# Altium project Microcontroller_Board.PrjPcb
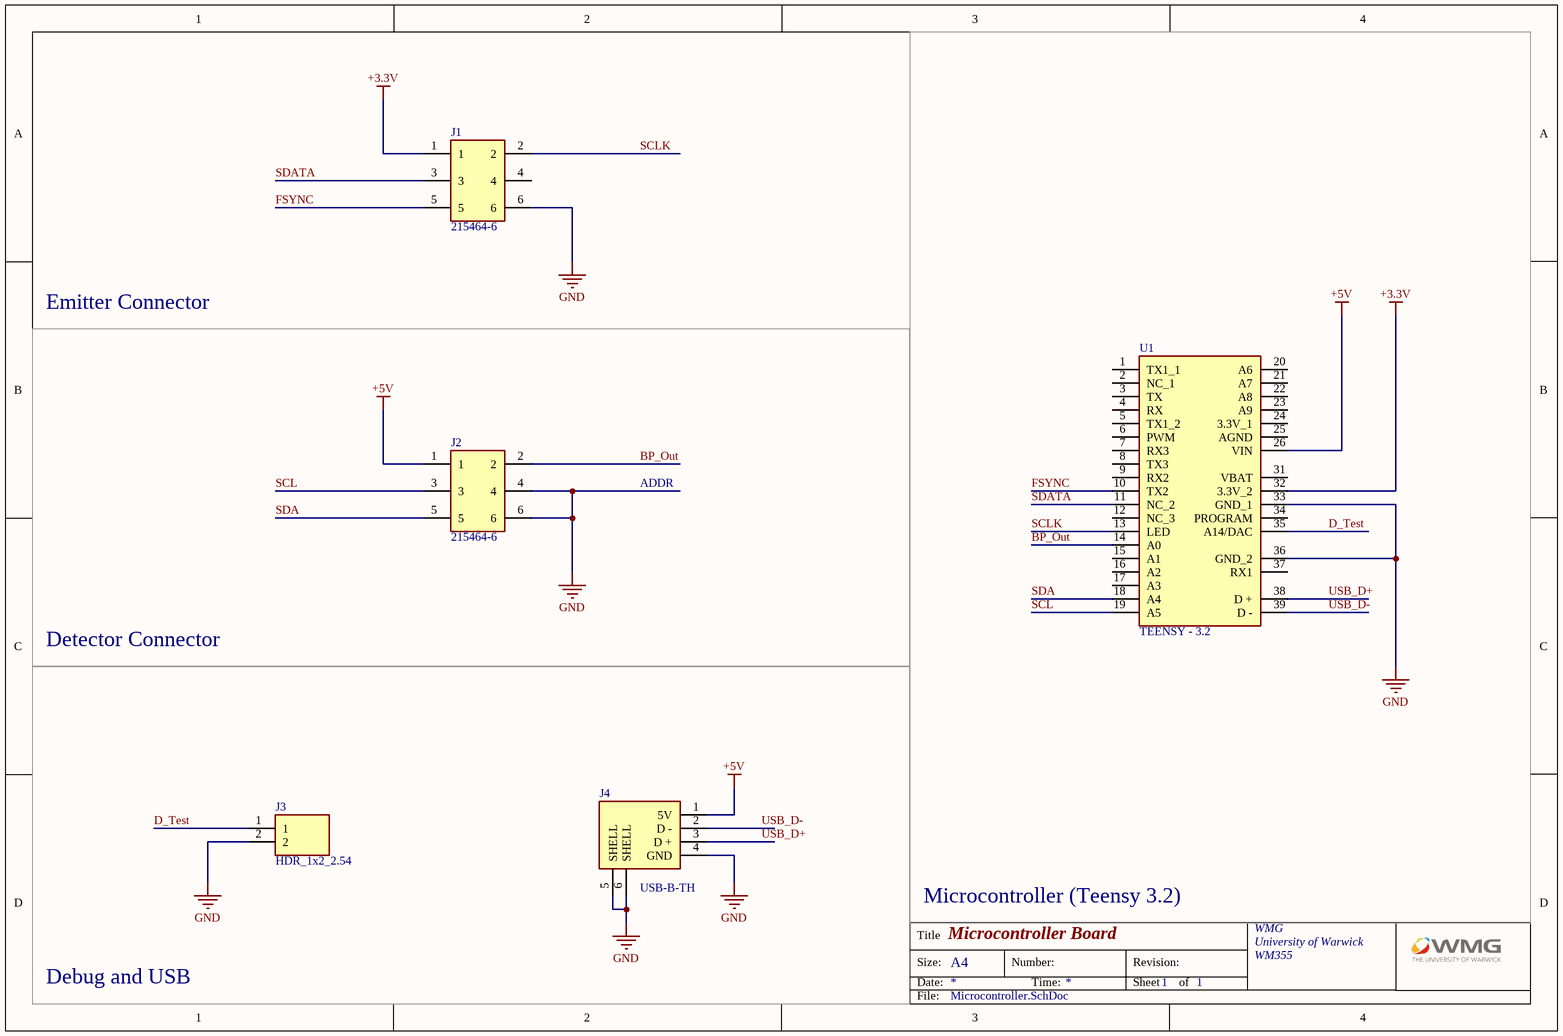
[diagram p0: Microcontroller.SchDoc]
1 sheet, 5 parts. Net scope: global (net labels, ports and power ports of the same name join across sheets).
Board file: Microcontroller.PcbDoc

## Sheet Microcontroller.SchDoc: Microcontroller Board
size A4; Organization: WMG; Address1: University of Warwick; Address2: WM355; SheetNumber: 1; SheetTotal: 1

### Parts
J1  215464-6  [2154646]
J2  215464-6  [2154646]
J3  HDR_1x2_2.54  [HDR_1x2_2.54]
J4  USB-B-TH  [USB-B-TH]
U1  TEENSY - 3.2  [TEENSY-3.2]

### Blocks framed on the sheet
Microcontroller (Teensy 3.2): U1

### Nets
+3.3V: J1.1 U1.32(3.3V_2)
+5V: J2.1 J4.1(5V) U1.26(VIN)
GND: J1.6 J2.4 J2.6 J3.2 J4.4(GND) J4.5(SHELL) J4.6(SHELL) U1.33(GND_1) U1.36(GND_2)
BP_Out: J2.2 U1.14(A0)
D_Test: J3.1 U1.35(A14/DAC)
FSYNC: J1.5 U1.10(TX2)
SCL: J2.3 U1.19(A5)
SCLK: J1.2 U1.13(LED)
SDA: J2.5 U1.18(A4)
SDATA: J1.3 U1.11(NC_2)
USB_D+: J4.3(D_+) U1.38(D_+)
USB_D-: J4.2(D_-) U1.39(D_-)

Not connected (* = marked no-connect by the designer): J1 4; U1 1(TX1_1) 2(NC_1) 3(TX) 4(RX) 5(TX1_2) 6(PWM) 7(RX3) 8(TX3) 9(RX2) 12(NC_3) 15(A1) 16(A2) 17(A3) 20(A6) 21(A7) 22(A8) 23(A9) 24(3.3V_1) 25(AGND) 31(VBAT) 34(PROGRAM) 37(RX1)

### Notes on the sheet
- Emitter Connector
- ADDR
- Detector Connector
- Debug and USB
- Title
- Size:
- Date:
- A4
- Number:
- Time:
- Revision:
- Sheet
- of
- File:

### Library data of the parts
J1 J2 = 215464-6: Micro-Match Connector Male 6-Way; Manufacturer_Name: TE Connectivity; Datasheet Link: https://www.te.com/commerce/DocumentDelivery/DDEController?Action=srchrtrv&DocNm=215464&DocType=Customer+Drawing&DocLang=English&DocFormat=pdf&PartCntxt=215464-6; Height: 3.6mm; Manufacturer_Part_Number: 215464-6; Mouser Part Number: 571-215464-6; Mouser Price/Stock: https://www.mouser.co.uk/ProductDetail/TE-Connectivity/215464-6?qs=XAKIUOoRPe5vrTUOsg1hdg%3D%3D; Arrow Part Number: 215464-6; Arrow Price/Stock: https://www.arrow.com/en/products/215464-6/te-connectivity; System: Connector
J3 = HDR_1x2_2.54: 0.1" Male Header Connector; Manufacturer_Name: Amphenol; Manufacturer_Part_Number: 10129378-902001BLF; Datasheet Link: https://www.mouser.co.uk/datasheet/2/18/10129378-1530218.pdf; Height: 8.43mm; Mouser Part Number: 649-1012937890201BLF; Mouser Price/Stock: https://www.mouser.co.uk/ProductDetail/Amphenol-FCI/10129378-902001BLF?qs=0lQeLiL1qybv6C1q0T3%2FPw%3D%3D; Arrow Part Number: 10129378-902001BLF; Arrow Price/Stock: https://www.arrow.com/en/products/10129378-902001blf/amphenol-fci?region=nac
J4 = USB-B-TH: USB Type B Connector - Thru-Hole; Manufacturer_Name: TE Connectivity; Manufacturer_Part_Number: 292304-1; Datasheet Link: https://www.te.com/commerce/DocumentDelivery/DDEController?Action=srchrtrv&DocNm=7-1773442-0&DocType=Data+Sheet&DocLang=English&PartCntxt=292304-1&DocFormat=pdf; Mouser Part Number: 571-292304-1; Mouser Price/Stock: https://www.mouser.co.uk/ProductDetail/TE-Connectivity/292304-1?qs=G%2F5vCLrg9vwiXeMJMHNpsA%3D%3D; Arrow Part Number: 292304-1; Arrow Price/Stock: https://www.arrow.com/en/products/292304-1/te-connectivity?region=europe
U1 = TEENSY-3.2: ARM Development Board; Manufacturer_Name: PJRC; Manufacturer_Part_Number: TEENSY3.2; Datasheet Link: https://www.pjrc.com/store/teensy32.html; Height: 4.07mm